# Altium schematic sheet WM8960.SchDoc
size A3; SheetNumber: 2; SheetTotal: 6
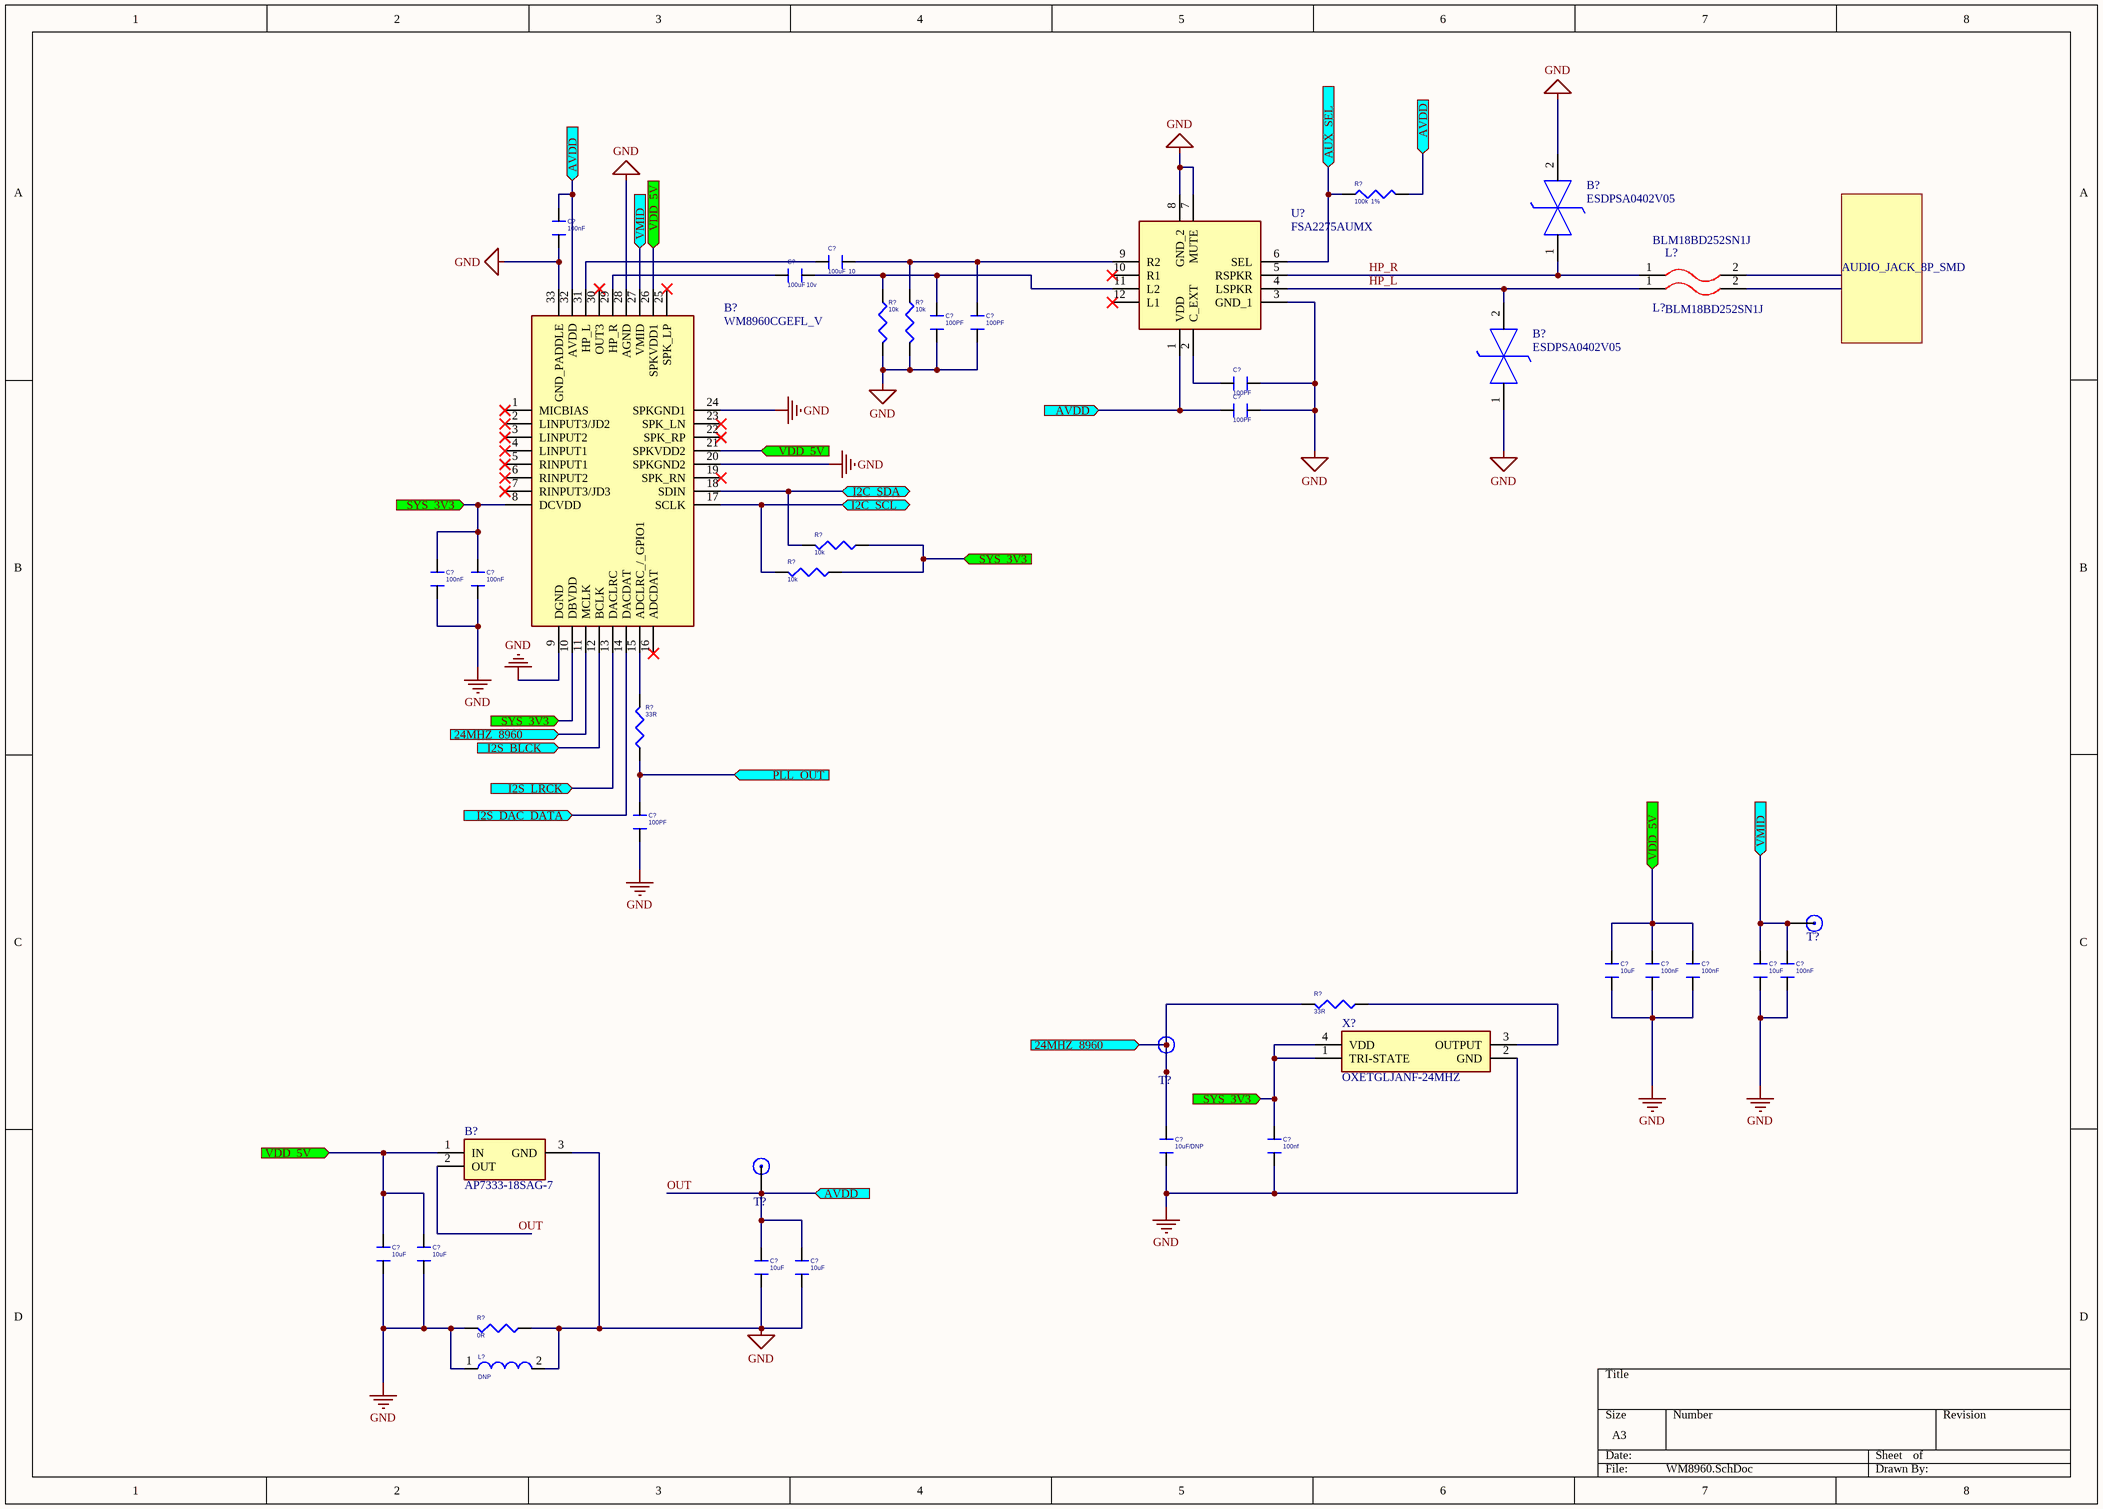
[diagram p0: WM8960.SchDoc]

## Parts
(Parts that share a designator on the sheet are numbered #1, #2 ... from top to bottom, then left to right.)
B?#1  ESDPSA0402V05  [ESDPSA0402V05]
B?#2  WM8960CGEFL_V  [QFN50P500X500X100-33N]
B?#3  ESDPSA0402V05  [ESDPSA0402V05]
B?#4  AP7333-18SAG-7  [SOT96P240X135-3N]
C?#1  100nF  [C0603]
C?#2  100uF  10  [C0603]
C?#3  100uF 10v  [C0603]
C?#4  100PF  [C0603]
C?#5  100PF  [C0603]
C?#6  100PF  [C0603]
C?#7  100PF  [C0603]
C?#8  100nF  [C0603]
C?#9  100nF  [C0603]
C?#10  100PF  [C0603]
C?#11  10uF  [C0603]
C?#12  100nF  [C0603]
C?#13  100nF  [C0603]
C?#14  10uF  [C0603]
C?#15  100nF  [C0603]
C?#16  10uF/DNP  [C0603]
C?#17  100nf  [C0603]
C?#18  10uF  [C0603]
C?#19  10uF  [C0603]
C?#20  10uF  [C0603]
C?#21  10uF  [C0603]
L?#1  BLM18BD252SN1J  [BLM18EG121SH1D]
L?#2  BLM18BD252SN1J  [BLM18EG121SH1D]
L?#3  DNP  [CD35]
R?#1  100k  1%  [R 0603]
R?#2  10k  [R 0603]
R?#3  10k  [R 0603]
R?#4  10k  [R 0603]
R?#5  10k  [R 0603]
R?#6  33R  [R 0603]
R?#7  33R  [R 0603]
R?#8  0R  [R 0603]
T?#1  Test_point  [Test_point]  (value not drawn)
T?#2  Test_point  [Test_point]  (value not drawn)
T?#3  Test_point  [Test_point]  (value not drawn)
U?  FSA2275AUMX  [FSA2275AUMX]
X?  OXETGLJANF-24MHZ  [OXETGLJANF24MHZ]

## Ports
24MHZ_8960 (in), _I2S_BLCK (in), _I2S_DAC_DATA (in), _I2S_LRCK (in), AUX_SEL (in), AVDD (in), I2C_SCL (bidir), I2C_SDA (bidir), PLL_OUT (in), SYS_3V3 (in), VDD_5V (in), VMID (in)

## Nets
GND: B?#1.2(K2) B?#2.9(DGND) B?#2.20(SPKGND2) B?#2.24(SPKGND1) B?#2.28(AGND) B?#2.33(GND_PADDLE) B?#3.1(K1) B?#4.3(GND) C?#1.1 C?#4.1 C?#5.1 C?#6.1 C?#7.1 C?#8.1 C?#9.1 C?#10.1 C?#11.1 C?#12.1 C?#13.1 C?#14.1 C?#15.1 C?#16.1 C?#17.1 C?#18.1 C?#19.1 C?#20.1 C?#21.1 L?#3.1 L?#3.2 R?#2.2 R?#3.2 R?#8.1 R?#8.2 U?.3(GND_1) U?.7(MUTE) U?.8(GND_2) X?.2(GND)
24MHZ_8960: B?#2.11(MCLK) C?#16.2 R?#7.2 T?#2.1 ; port 24MHZ_8960
_I2S_BLCK: B?#2.12(BCLK) ; port _I2S_BLCK
_I2S_DAC_DATA: B?#2.14(DACDAT) ; port _I2S_DAC_DATA
_I2S_LRCK: B?#2.13(DACLRC) ; port _I2S_LRCK
AUX_SEL: R?#1.1 U?.6(SEL) ; port AUX_SEL
HP_L: B?#3.2(K2) L?#2.1 U?.4(LSPKR)
HP_R: B?#1.1(K1) L?#1.1 U?.5(RSPKR)
I2C_SCL: B?#2.17(SCLK) R?#5.2 ; port I2C_SCL
I2C_SDA: B?#2.18(SDIN) R?#4.2 ; port I2C_SDA
OUT: B?#2.32(AVDD) B?#4.2(OUT) C?#1.2 C?#7.2 C?#20.2 C?#21.2 R?#1.2 T?#3.1 U?.1(VDD) ; port AVDD
PLL_OUT: C?#10.2 R?#6.1 ; port PLL_OUT
SYS_3V3: B?#2.8(DCVDD) B?#2.10(DBVDD) C?#8.2 C?#9.2 C?#17.2 R?#4.1 R?#5.1 X?.1(TRI-STATE) X?.4(VDD) ; port SYS_3V3
VDD_5V: B?#2.21(SPKVDD2) B?#2.26(SPKVDD1) B?#4.1(IN) C?#11.2 C?#12.2 C?#13.2 C?#18.2 C?#19.2 ; port VDD_5V
VMID: B?#2.27(VMID) C?#14.2 C?#15.2 T?#1.1 ; port VMID
NetB?#2_15: B?#2.15(ADCLRC_/_GPIO1) R?#6.2
NetB?#2_29: B?#2.29(HP_R) C?#3.2
NetB?#2_31: B?#2.31(HP_L) C?#2.2
NetC?#2_1: C?#2.1 C?#5.2 R?#3.1 U?.9(R2)
NetC?#3_1: C?#3.1 C?#4.2 R?#2.1 U?.11(L2)
NetC?#6_2: C?#6.2 U?.2(C_EXT)
NetR?#7_1: R?#7.1 X?.3(OUTPUT)

Not connected (* = marked no-connect by the designer): B?#2 1(MICBIAS)* 2(LINPUT3/JD2)* 3(LINPUT2)* 4(LINPUT1)* 5(RINPUT1)* 6(RINPUT2)* 7(RINPUT3/JD3)* 16(ADCDAT)* 19(SPK_RN)* 22(SPK_RP)* 23(SPK_LN)* 25(SPK_LP)* 30(OUT3)*; L?#1 2; L?#2 2; U? 10(R1)* 12(L1)*

## Notes on the sheet
- AUDIO_JACK_8P_SMD

## Library data of the parts
B?#1 B?#3 = ESDPSA0402V05: Polymer ESD Suppressor; Manufacturer_Name: Good-Ark; Geometry.Height: 0.45mm; Manufacturer_Part_Number: ESDPSA0402V05; Mouser Part Number: *; Mouser Price/Stock: *; Arrow Part Number: *; Arrow Price/Stock: *; Datasheet Link: https://4donline.ihs.com/images/VipMasterIC/IC/GOAE/GOAE-S-A0000149384/GOAE-S-A0000149384-1.pdf?hkey=EF798316E3902B6ED9A73243A3159BB0
B?#2 = WM8960CGEFL_V: Interface - CODECs Stereo CODEC with 1W DRIVER; Manufacturer_Name: Cirrus Logic; Manufacturer_Part_Number: WM8960CGEFL/V; Geometry.Height: 1mm; Mouser Part Number: 238-WM8960CGEFL/V; Mouser Price/Stock: https://www.mouser.co.uk/ProductDetail/Cirrus-Logic/WM8960CGEFL-V?qs=G8wrXCBxhFteielmzwPrEw%3D%3D; Arrow Part Number: *; Arrow Price/Stock: *; Datasheet Link: https://componentsearchengine.com/Datasheets/1/WM8960CGEFL_V.pdf
B?#4 = AP7333-18SAG-7: Diodes Inc AP7333-18SAG-7, Single Linear Voltage Regulator, 300mA 1.8 V, +/-2%, 3-Pin SOT-23; Manufacturer_Name: Diodes Inc.; Geometry.Height: 1.35mm; Manufacturer_Part_Number: AP7333-18SAG-7; Mouser Part Number: 621-AP7333-18SAG-7; Mouser Price/Stock: https://www.mouser.co.uk/ProductDetail/Diodes-Incorporated/AP7333-18SAG-7?qs=vIZ3oKQCLxpEALu0NaomtQ%3D%3D; Arrow Part Number: AP7333-18SAG-7; Arrow Price/Stock: https://www.arrow.com/en/products/ap7333-18sag-7/diodes-incorporated?region=nac; Datasheet Link: https://www.diodes.com/assets/Datasheets/AP7333.pdf
C?#1-C?#21 = CAPACITOR_0_Dup3: CAP ±20%/10V/X5R/SMT0603; PAGE: 1
L?#1 L?#2 = BLM18BD252SN1J: BLM18_N1J Series EMI Suppression Filter 2500+/-25% at 100MHz 150mA @85; Manufacturer_Name: Murata Electronics; Geometry.Height: 0.95mm; Manufacturer_Part_Number: BLM18BD252SN1J; Mouser Part Number: *; Mouser Price/Stock: *; Arrow Part Number: *; Arrow Price/Stock: *; Datasheet Link: http://www.murata.com/~/media/webrenewal/support/library/catalog/products/emc/emifil/c31e.ashx?la=en-gb
L?#3 = INDUCTOR_1: Inductor 2000MA 4.0X4.0X2.0
R?#1-R?#8 = R_Dup1: RES 1/16W 5% SMT0402
U? = FSA2275AUMX: ON Semiconductor FSA2275AUMX, Audio Switch IC DPDT, 3.3 V dc, 12-Pin UMLP; Manufacturer_Name: onsemi; Geometry.Height: 0.6mm; Manufacturer_Part_Number: FSA2275AUMX; Mouser Part Number: 512-FSA2275AUMX; Mouser Price/Stock: https://www.mouser.co.uk/ProductDetail/ON-Semiconductor-Fairchild/FSA2275AUMX?qs=Mv7BduZupUhxHdQdUdEuNg%3D%3D; Arrow Part Number: FSA2275AUMX; Arrow Price/Stock: https://www.arrow.com/en/products/fsa2275aumx/on-semiconductor; Datasheet Link: https://www.onsemi.com/pub/Collateral/FSA2275A-D.pdf
X? = OXETGLJANF-24MHZ: 3.3V~3.3V -40~+85 15mA +/-50ppm 24MHz SMD3225-4P Oscillators ROHS; Manufacturer_Name: TAITIEN; Geometry.Height: 1.1mm; Manufacturer_Part_Number: OXETGLJANF-24MHZ; Mouser Part Number: *; Mouser Price/Stock: *; Arrow Part Number: *; Arrow Price/Stock: *; Datasheet Link: https://datasheet.lcsc.com/lcsc/1811052217_TAITIEN-Elec-OXETGLJANF-24MHZ_C295524.pdf